# EAGLE design eagleprj (EAGLE 7.5.0)
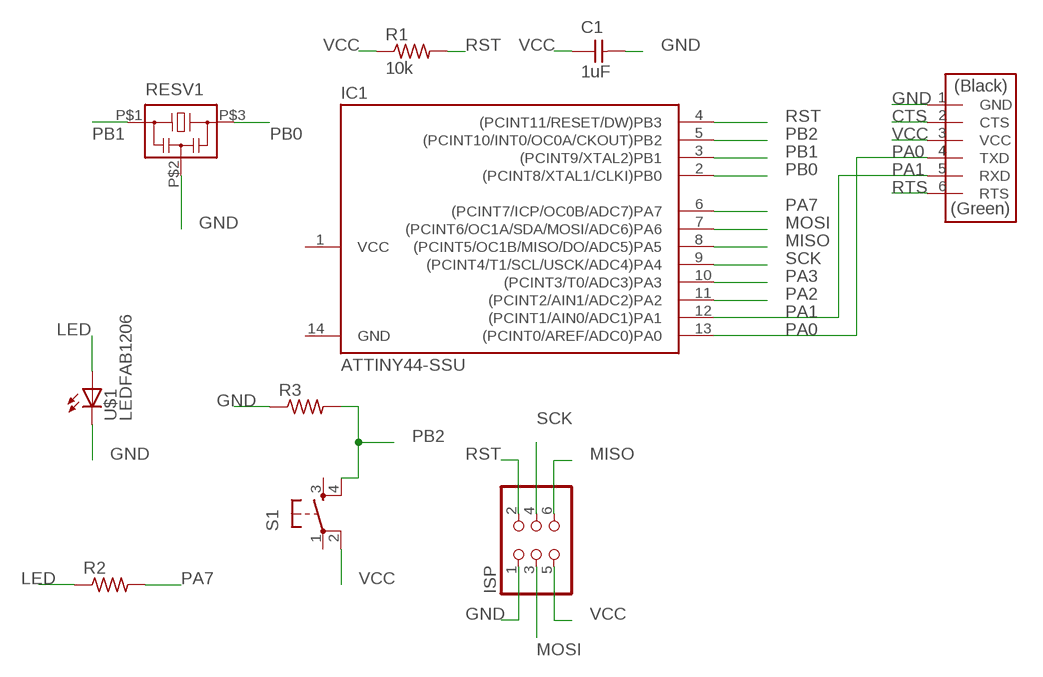
[diagram p0: schematic, sheet 1]

## Parts
C1  1uF  CAP-UNPOLARIZEDFAB  [C1206FAB]
IC1  ATTINY44-SSU  [SOIC14]
ISP  PINHD-2X3-SMD  [2X03SMD]
R1  10k  RES-US1206FAB  [R1206FAB]
R2  RES-US1206FAB  [R1206FAB]
R3  RES-US1206FAB  [R1206FAB]
RESV1  RESONATOR-VOLT  [VOLT]
S1  6MM_SWITCH6MM_SWITCH  [6MM_SWITCH]
U$1  LEDFAB1206  [LED1206FAB]
U$2  FTDI-SMD-HEADER  [1X06SMD]

## Nets
CTS: U$2.2(CTS)
GND: C1.2 ISP.1 R3.1 RESV1.P$2 U$1.2(C) U$2.1(GND)
LED: R2.1 U$1.1(A)
MISO: IC1.8((PCINT5/OC1B/MISO/DO/ADC5)PA5) ISP.6
MOSI: IC1.7((PCINT6/OC1A/SDA/MOSI/ADC6)PA6) ISP.3
PA0: IC1.13((PCINT0/AREF/ADC0)PA0) U$2.4(TXD)
PA1: IC1.12((PCINT1/AIN0/ADC1)PA1) U$2.5(RXD)
PA2: IC1.11((PCINT2/AIN1/ADC2)PA2)
PA3: IC1.10((PCINT3/T0/ADC3)PA3)
PA7: IC1.6((PCINT7/ICP/OC0B/ADC7)PA7) R2.2
PB0: IC1.2((PCINT8/XTAL1/CLKI)PB0) RESV1.P$3
PB1: IC1.3((PCINT9/XTAL2)PB1) RESV1.P$1
PB2: IC1.5((PCINT10/INT0/OC0A/CKOUT)PB2) R3.2 S1.4(S1)
RST: IC1.4((PCINT11/RESET/DW)PB3) ISP.2 R1.2
RTS: U$2.6(RTS)
SCK: IC1.9((PCINT4/T1/SCL/USCK/ADC4)PA4) ISP.4
VCC: C1.1 ISP.5 R1.1 S1.2(P1) U$2.3(VCC)
Unconnected: S1.1(P) S1.3(S)

## Power pins joined to a net without a drawn wire
GND: IC1.14(GND)
VCC: IC1.1(VCC)

## Library data of the parts
C1 = fab:CAP-UNPOLARIZED
IC1 = fab:ATTINY44
ISP = fab:PINHD-2X3-SMD: PIN HEADER
R1-R3 = fab:RES-US: Resistor (US Symbol) Variants with postfix FAB are widened to allow the routing of internal traces
RESV1 = Custom Volt:RESONATOR-VOLT
S1 = fab:6MM_SWITCH: OMRON SWITCH
U$1 = fab:LED: LED
U$2 = fab:FTDI-SMD-HEADER

## Board
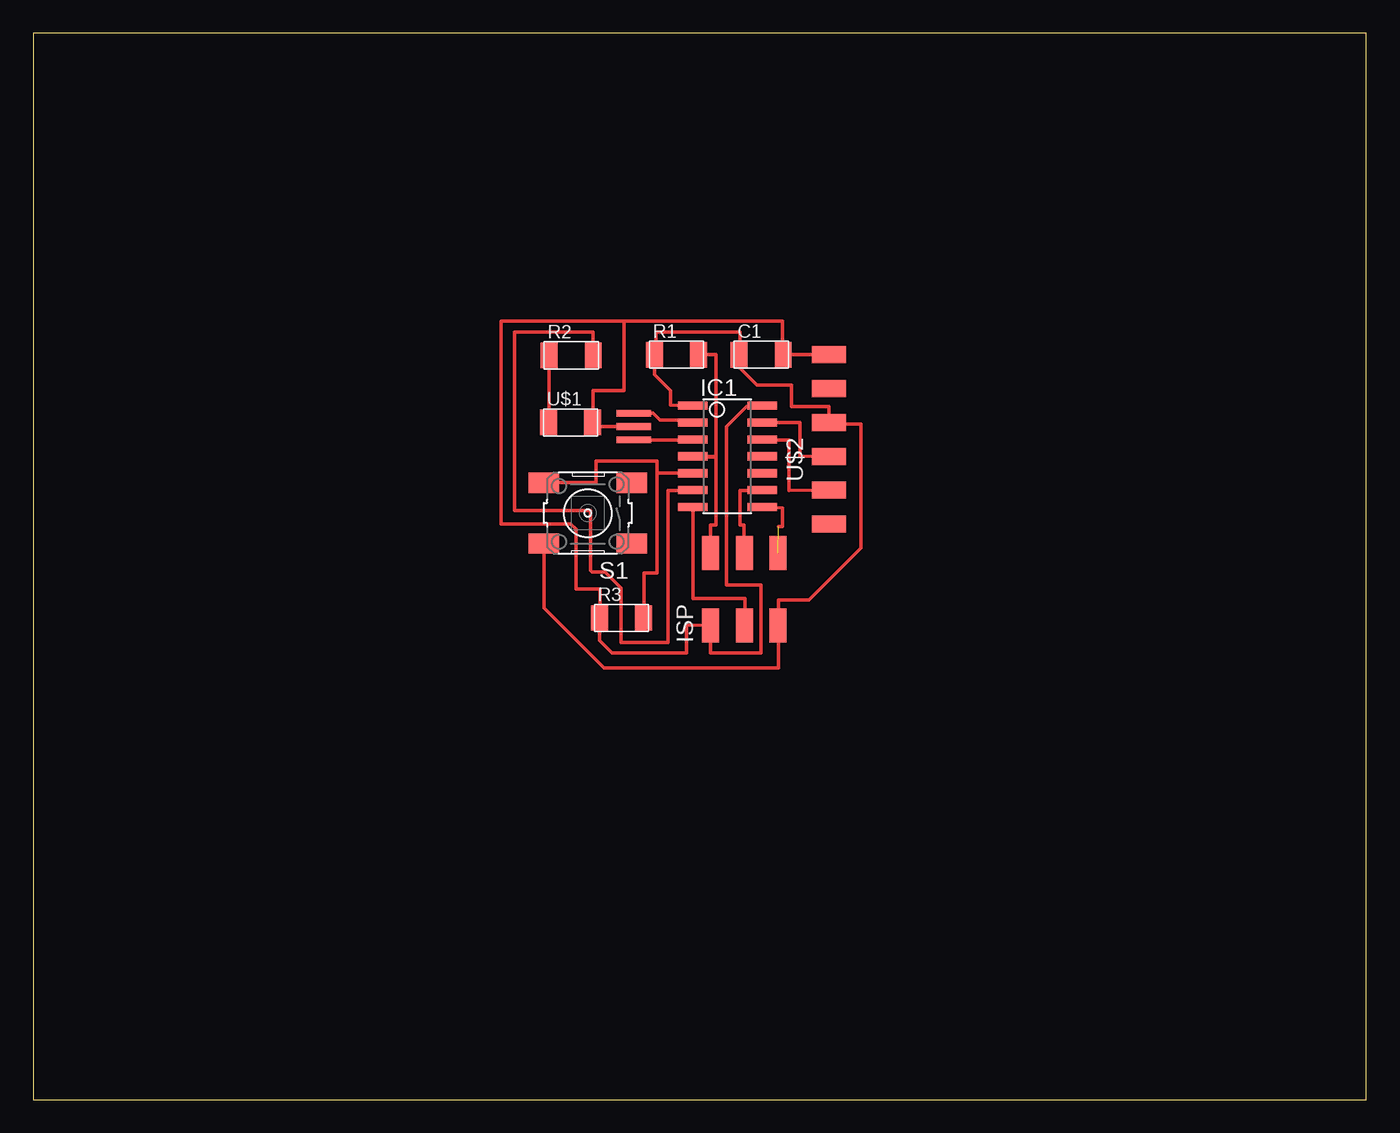
[diagram p1: board, top side]

Size 100 x 80 mm. Coordinates in mm from the lower left corner, seen from the top.
Outline: 0,0 100,0 100,80 0,80 0,0
Copper layers (1*16): Top 0.035mm / dielectric 1.5mm / Bottom 0.035mm
Design rules "default": minimum track width 10mil, minimum drill 24mil, track to track 8mil, track to pad 8mil, pad to pad 8mil, via to via 8mil, smd to smd 8mil, copper to edge 40mil, drill to drill 8mil, minimum pad ring 10mil, minimum via ring 8mil, stop-mask expansion 4mil, vias tented up to drill 0mil, thermal gap 10mil

### Footprints (pad centres in the part's own frame; a part is rotated, then mirrored left to right if it is on the bottom)
C1206FAB = smd 1.27 x 1.905: 1 -1.651,0; 2 1.651,0
SOIC14 = smd 0.61 x 2.21: 1 -3.81,-2.603; 2 -2.54,-2.603; 3 -1.27,-2.603; 4 0,-2.603; 5 1.27,-2.603; 6 2.54,-2.603; 7 3.81,-2.603; 8 3.81,2.603; 9 2.54,2.603; 10 1.27,2.603; 11 0,2.603; 12 -1.27,2.603; 13 -2.54,2.603; 14 -3.81,2.603
2X03SMD = smd 2.54 x 1.27: 1 -2.54,2.54; 2 2.92,2.54; 3 -2.54,0; 4 2.92,0; 5 -2.54,-2.54; 6 2.92,-2.54
R1206FAB = smd 1.27 x 1.905: 1 -1.651,0; 2 1.651,0
VOLT = smd 0.5 x 2.6: P$1 -1,0; P$2 0,0; P$3 1,0
6MM_SWITCH = smd 2.286 x 1.524: 1 -3.302,2.286; 2 3.302,2.286; 3 -3.302,-2.286; 4 3.302,-2.286
LED1206FAB = smd 1.27 x 1.905: 1 -1.651,0; 2 1.651,0
1X06SMD = smd 2.54 x 1.27: 1 0,6.35; 2 0,3.81; 3 0,1.27; 4 0,-1.27; 5 0,-3.81; 6 0,-6.35

### Placement (x,y rotation side)
C1  54.61,55.88 0 top
IC1  52.07,48.26 270 top
ISP  53.34,38.1 90 top
R1  48.26,55.88 0 top
R2  40.36,55.84 0 top
R3  44.12,36.13 0 top
RESV1  45.05,50.5 90 top
S1  41.6,44 180 top
U$1  40.3,50.8 0 top
U$2  59.69,49.53 0 top

### Tracks (layer width: path | path; a pad name or v marks a point on that pad's centre or on a via)
GND
  Top 0.25: 52.4,33.5 50.8,33.5 ISP.1 | 38.3,43.2 35.1,43.2 35.1,44.9 | 40.3,43.2 40.7,42.8 40.7,38.3 42.5,38.3 | 54.6,34.2 54.6,33.5 54.1,33.5 | R3.1 42.47,34.43 43.4,33.5
  Top 0.254: RESV1.P$2 42,50.5 U$1.2 42,51 42,53.2 44.3,53.2 44.3,58.4 | U$2.1 59.5,55.9 56.5,55.9 C1.2 56.2,56.3 56.2,58.4 44.3,58.4 | 43.4,33.5 49,33.5 49,35.6 ISP.1 51,35.5 | 54.6,34.2 54.6,38.6 52,38.6 52,50.5 53.5,52 54.5,52 IC1.14 | 52.4,33.5 54.1,33.5 | 44.3,58.4 35.1,58.4 35.1,44.9 | 40.3,43.2 38.3,43.2 | 42.5,38.3 42.5,36.4 R3.1
LED
  Top 0.254: U$1.1 38.7,51 38.7,55.5 R2.1
MISO  (1 unrouted)
  Top 0.254: 55.9,43 56.2,43 56.2,44.4 IC1.8
MOSI
  Top 0.254: IC1.7 49.5,44.5 49.5,37.6 53.4,37.6 ISP.3
PA0
  Top 0.254: IC1.13 57.5,50.8 57.5,48.3 U$2.4
PA1
  Top 0.25: 56.7,49.5 56.7,45.7 U$2.5
  Top 0.254: 56.7,49.5 55,49.5 IC1.12
PA7
  Top 0.25: 44.1,38.4 42.9,39.6 41.9,39.6 41.8,39.7 41.8,44.2 36.1,44.2 36.1,57.6 | 44.1,35.6 44.1,34.3 47.6,34.3 47.6,45.7
  Top 0.254: 36.1,57.6 42,57.6 42,55.5 R2.2 | 44.1,35.6 44.1,38.4 | 47.6,45.7 49,45.7 IC1.6
PB0
  Top 0.254: RESV1.P$3 46.5,51.5 47,51 49,51 IC1.2
PB1
  Top 0.254: RESV1.P$1 49,49.5 IC1.3
PB2
  Top 0.254: 46.8,47 46.8,47.9 42.2,47.9 42.2,46.3 39,46.3 S1.4 | 46.8,47 46.8,39.5 45.8,39.5 45.8,36.5 R3.2 | 46.8,47 49,47 IC1.5
RST
  Top 0.25: 51.2,48.2 51.2,43.1 50.8,43.1 ISP.2 | 51.2,48.2 51.2,48.3 | 51.2,48.3 51.16,48.26 IC1.4 49.47,48.2 51.2,48.2 | 51.2,48.3 51.2,55.88 | 51.2,55.9 51.2,55.88 | 51.2,55.88 R1.2
SCK
  Top 0.25: 53,43.1 53.3,43.1 53.3,41.02 ISP.4
  Top 0.254: 53,43.1 53,45.7 54.5,45.7 IC1.9
VCC
  Top 0.25: C1.1 52.96,54.94 54.3,53.6 56.89,53.6 56.89,52 59.7,52 U$2.3 | 55.9,37.5 58.2,37.5 62.1,41.4 | 47.8,52.1 47.8,53.2 46.6,54.4 | 46.7,57.6 46.7,55.97 R1.1 | 42.8,32.4 38.6,36.6 38.4,36.8 38.3,36.9 38.3,41.5
  Top 0.254: 46.6,54.4 46.6,55.9 R1.1 47,56 | 47.8,52.1 IC1.1 | 46.7,57.6 53,57.6 53,56 C1.1 | 42.8,32.4 55.9,32.4 55.9,35.4 ISP.5 55.9,37.5 | 38.3,41.5 S1.2 | 62.1,41.4 62.1,50.7 60,50.7 U$2.3